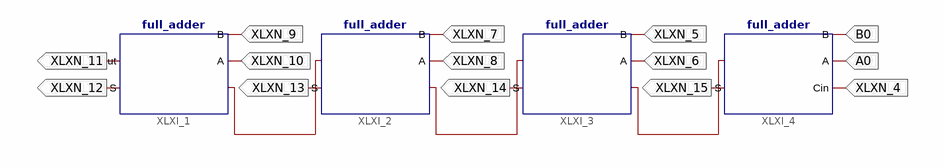
[diagram p0: schematic sheet 1]
// Xilinx ISE schematic four_bit_full_adder.sch (spartan3) as structural Verilog: 4 symbols, 14 ports
module four_bit_full_adder (
  input  B0,
  input  A0,
  input  XLXN_4,
  input  XLXN_5,
  input  XLXN_6,
  input  XLXN_7,
  input  XLXN_8,
  input  XLXN_9,
  input  XLXN_10,
  output XLXN_11,
  output XLXN_12,
  output XLXN_13,
  output XLXN_14,
  output XLXN_15
);

  full_adder XLXI_1 (.A(XLXN_10), .B(XLXN_9), .S(XLXN_12), .Cout(XLXN_11));  // open: Cin
  full_adder XLXI_4 (.Cin(XLXN_4), .A(A0), .B(B0), .S(XLXN_15));  // open: Cout
  full_adder XLXI_3 (.A(XLXN_6), .B(XLXN_5), .S(XLXN_14));  // open: Cin, Cout
  full_adder XLXI_2 (.A(XLXN_8), .B(XLXN_7), .S(XLXN_13));  // open: Cin, Cout
endmodule
